# EAGLE design rs232RGBLEDController (EAGLE 8.4.0)
VERSION: 1.0a1
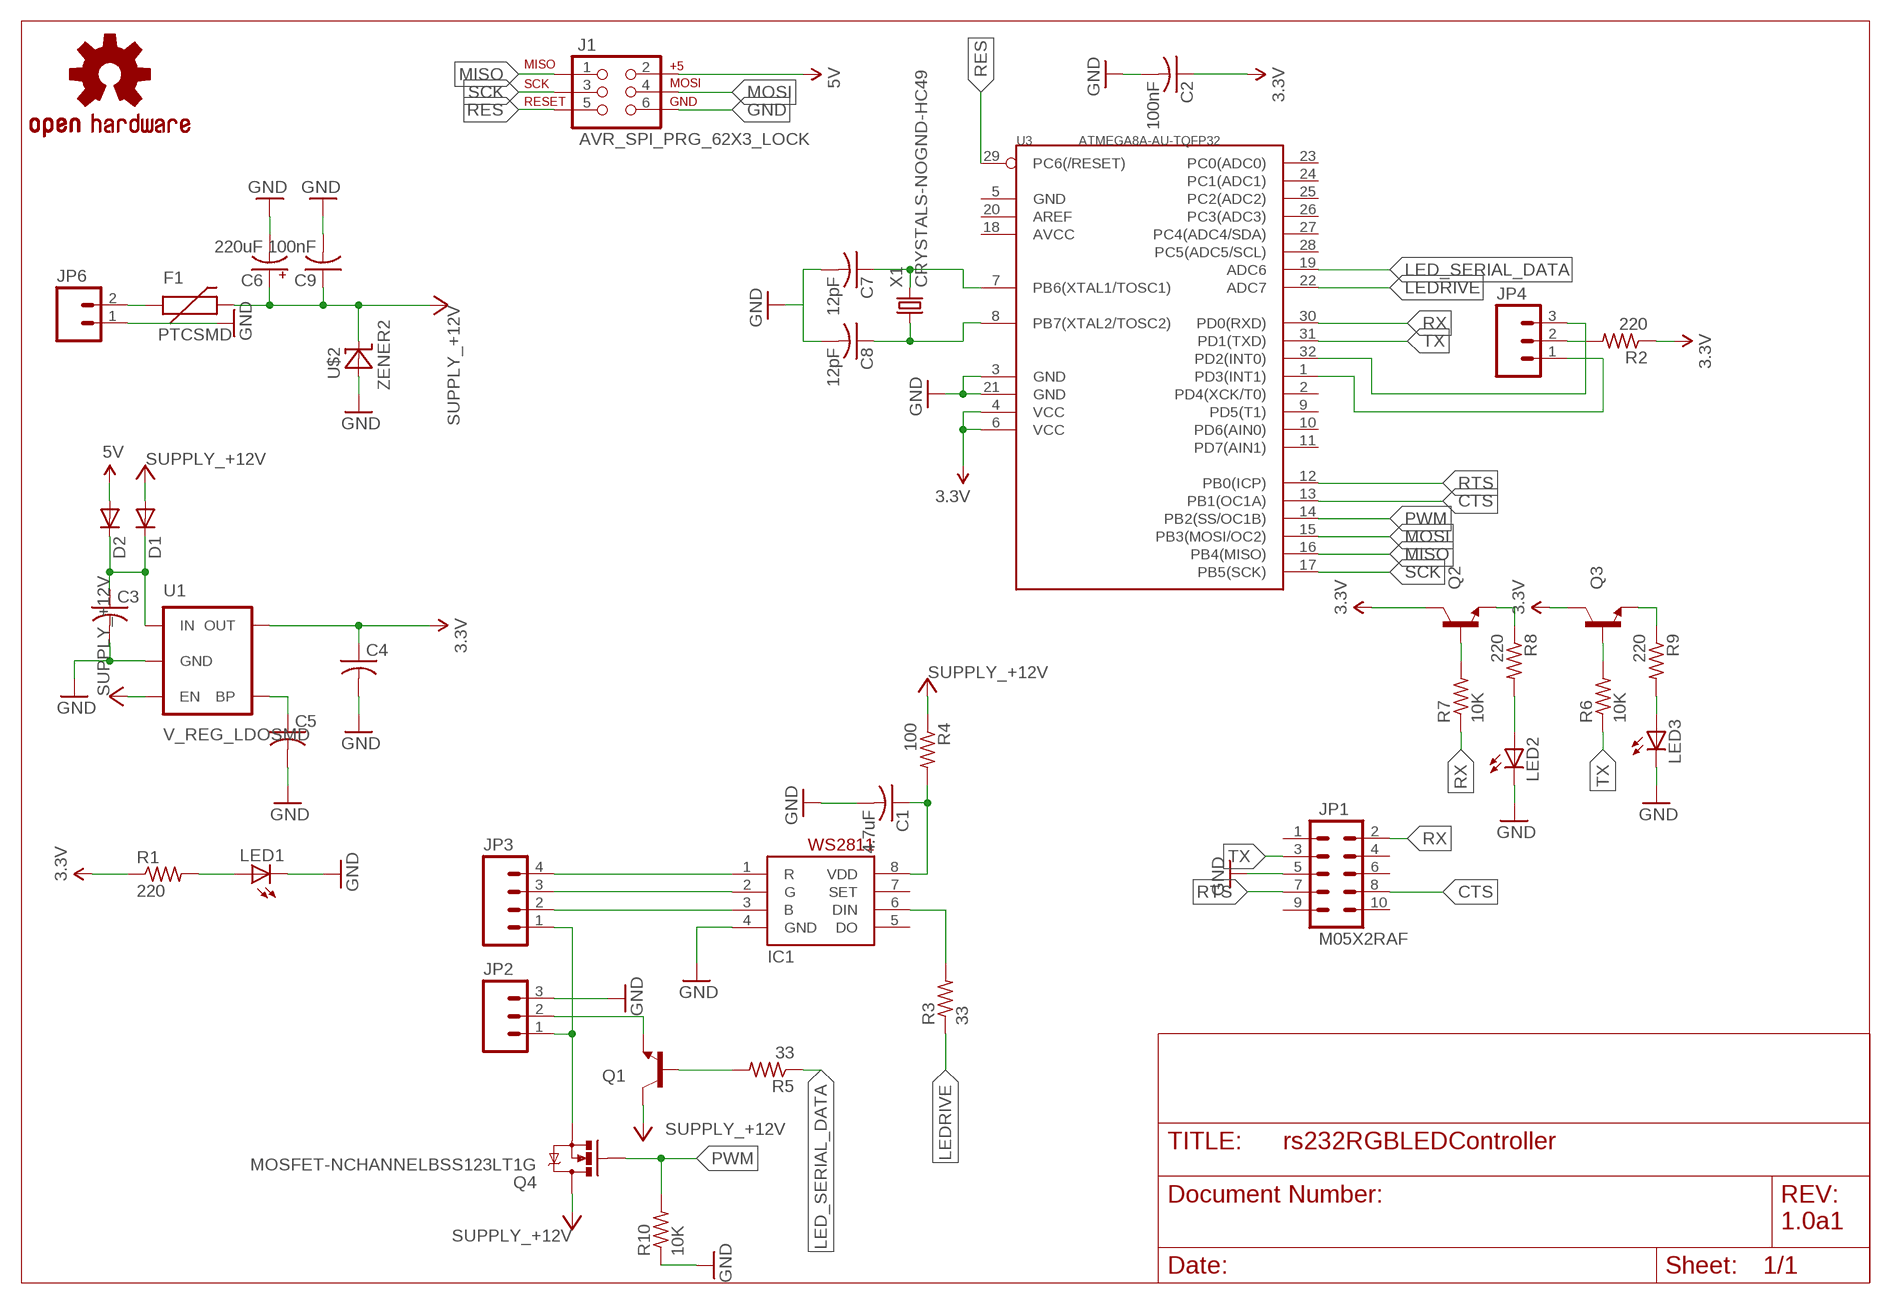
[diagram p0: schematic, sheet 1]

## Parts
C1  4.7uF  C-USC0603  [C0603]
C2  100nF  C-USC0603  [C0603]
C3  C-USC0603  [C0603]
C4  C-USC0603  [C0603]
C5  C-USC0603  [C0603]
C6  220uF  CPOL-US175TMP-0810  [175TMP-0810]
C7  12pF  C-USC0603  [C0603]
C8  12pF  C-USC0603  [C0603]
C9  100nF  C-USC0603  [C0603]
D1  DIODESOT23  [SOT23-3]
D2  DIODESOT23  [SOT23-3]
F1  PTCSMD  [PTC-1206]
IC1  WS2811-SOP8  [SO08-SKINNYPADS]
J1  AVR_SPI_PRG_62X3_LOCK  [2X3_LOCK]
JP1  M05X2RAF  [2X5-RAF]
JP2  M03PTH  [1X03]
JP3  M04PTH  [1X04]
JP4  M03PTH  [1X03]
JP6  M021X02_NO_SILK  [1X02_NO_SILK]
LED1  LED0603  [LED-0603]
LED2  LED0603  [LED-0603]
LED3  LED0603  [LED-0603]
Q1  TRANSISTOR_NPNSOT23  [SOT23]
Q2  TRANSISTOR_NPNSOT23  [SOT23]
Q3  TRANSISTOR_NPNSOT23  [SOT23]
Q4  MOSFET-NCHANNELBSS123LT1G  [SOT23-3]
R1  220  R-US_R0603  [R0603]
R2  220  R-US_R0603  [R0603]
R3  33  R-US_R0603  [R0603]
R4  100  R-US_R0603  [R0603]
R5  33  R-US_R0603  [R0603]
R6  10K  R-US_R0603  [R0603]
R7  10K  R-US_R0603  [R0603]
R8  220  R-US_R0603  [R0603]
R9  220  R-US_R0603  [R0603]
R10  10K  R-US_R0603  [R0603]
U1  V_REG_LDOSMD  [SOT23-5]
U3  ATMEGA8A-AU-TQFP32  MCU-ATMEGA8A-AU(TQFP32)  [TQFP32-0.8-7X7MM]
U$1  OSHW-LOGOS  [OSHW-LOGO-S]
U$2  ZENER2  [SOD123]
X1  CRYSTALS-NOGND-HC49  [HC49]

## Nets
3.3V: C2.1 C4.1 Q2.3(C) Q3.3(C) R1.1 R2.1 U1.5(OUT) U3.4(VCC) U3.6(VCC)
5V: D2.1(A) J1.2
+12V: C6.+ C9.1 D1.1(A) F1.2 Q1.3(C) Q4.3(D) R4.1 U1.3(EN) U$2.C ; supply symbol labelled SUPPLY_+12V
CTS: JP1.8 U3.13(PB1(OC1A))
GND: C1.2 C2.2 C3.2 C4.2 C5.2 C6.- C7.2 C8.2 C9.2 IC1.4(GND) J1.6 JP1.5 JP2.3 JP6.1 LED1.C LED2.C LED3.C R10.1 U1.2(GND) U3.3(GND) U3.21(GND) U$2.A
LED_SERIAL_DATA: R5.1 U3.19(ADC6)
LEDRIVE: R3.1 U3.22(ADC7)
MISO: J1.1 U3.16(PB4(MISO))
MOSI: J1.4 U3.15(PB3(MOSI/OC2))
N$1: Q2.1(B) R7.2
N$2: C3.1 D1.3(C) D2.3(C) U1.1(IN)
N$3: Q3.1(B) R6.2
N$4: Q2.2(E) R8.1
N$5: LED2.A R8.2
N$6: JP2.1 JP3.1 Q4.2(S)
N$7: Q3.2(E) R9.1
N$8: LED3.A R9.2
N$12: JP2.2 Q1.2(E)
N$13: LED1.A R1.2
N$14: IC1.3(B) JP3.2
N$15: C5.1 U1.4(BP)
N$16: C8.1 U3.8(PB7(XTAL2/TOSC2)) X1.1
N$17: C7.1 U3.7(PB6(XTAL1/TOSC1)) X1.2
N$18: JP4.2 R2.2
N$19: JP4.1 U3.1(PD3(INT1))
N$20: JP4.3 U3.32(PD2(INT0))
N$21: IC1.2(G) JP3.3
N$22: IC1.1(R) JP3.4
N$23: IC1.6(DIN) R3.2
N$25: C1.1 IC1.8(VDD) R4.2
N$26: Q1.1(B) R5.2
N$27: F1.1 JP6.2
PWM: Q4.1(G) R10.2 U3.14(PB2(SS/OC1B))
RES: J1.5 U3.29(PC6(/RESET))
RTS: JP1.7 U3.12(PB0(ICP))
RX: JP1.2 R7.1 U3.30(PD0(RXD))
SCK: J1.3 U3.17(PB5(SCK))
TX: JP1.3 R6.1 U3.31(PD1(TXD))
Unconnected: IC1.5(DO) IC1.7(SET) JP1.1 JP1.4 JP1.6 JP1.9 JP1.10 U3.2(PD4(XCK/T0)) U3.5(GND) U3.9(PD5(T1)) U3.10(PD6(AIN0)) U3.11(PD7(AIN1)) U3.18(AVCC) U3.20(AREF) U3.23(PC0(ADC0)) U3.24(PC1(ADC1)) U3.25(PC2(ADC2)) U3.26(PC3(ADC3)) U3.27(PC4(ADC4/SDA)) U3.28(PC5(ADC5/SCL))

## Library data of the parts
C1-C5 C7-C9 = adafruit:C-US: CAPACITOR, American symbol
C6 = adafruit:CPOL-US: POLARIZED CAPACITOR, American symbol
D1 D2 = SparkFun:DIODE: Diode These are standard reverse protection diodes and small signal diodes. SMA package can handle up to about 1A. SOD-323 can handle about 200mA. What the SOD-323 package when ordering, there are some mfgs out there that are 5-pin packages.
F1 = SparkFun:PTC: Resettable Fuse PTC Resettable Fuse. Spark Fun Electronics SKU : COM-08357
IC1 = adafruit:WS2811
J1 = SparkFun:AVR_SPI_PRG_6: AVR ISP 6 Pin This is the reduced ISP connector for AVR programming. Common on Arduino. This footprint will take up less PCB space and can be used with a 10-pin to 6-pin adapter such as SKU: BOB-08508
JP1 = SparkFun:M05X2: Header 5x2 Standard 10-pin dual row 0.1" header. Commonly used with AVR-ISP. Use with Spark Fun Electronics SKU: PRT-00778
JP2 JP4 = SparkFun:M03: Header 3 Standard 3-pin 0.1" header. Use with straight break away headers (SKU : PRT-00116), right angle break away headers (PRT-00553), swiss pins (PRT-00743), machine pins (PRT-00117), and female headers (PRT-00115). Molex polarized connector foot print use with SKU : PRT-08232 with associated crimp pins and housings.
JP3 = SparkFun:M04: Header 4 Standard 4-pin 0.1" header. Use with straight break away headers (SKU : PRT-00116), right angle break away headers (PRT-00553), swiss pins (PRT-00743), machine pins (PRT-00117), and female headers (PRT-00115). Molex polarized connector foot print use with SKU : PRT-08231 with associated crimp pins and housings. 1MM SMD Version SKU: PRT-10208
JP6 = SparkFun-Connectors:M02: Standard 2-pin 0.1" header. Use with - straight break away headers ( PRT-00116) - right angle break away headers (PRT-00553) - swiss pins (PRT-00743) - machine pins (PRT-00117) - female headers (PRT-00115) Molex polarized connector foot print use with: PRT-08233 with associated crimp pins and housings. 2.54_SCREWTERM for use with PRT-10571. 3.5mm Screw Terminal footprints for PRT-08084 5mm Screw Terminal footprints for use with PRT-08432
LED1-LED3 = SparkFun:LED: LEDs Standard schematic elements and footprints for 5mm, 3mm, 1206, and 0603 sized LEDs. 5mm - Spark Fun Electronics SKU : COM-00529 (and others)
Q1-Q3 = SparkFun:TRANSISTOR_NPN: Transistor NPN BJT configuration in SOT23 package. MMBT2222 is the common NPN we use. Double check BCE configuration again layout.
Q4 = SparkFun-DiscreteSemi:MOSFET-NCHANNEL: Common NMOSFET Parts MFG P/N Store ID Prod ID FDD8780 TRANS-09984 SI7820DN TRANS-11055 FDS6630A IC-08089 2N7002PW TRANS-11151 FQP30N06L COM-10213 TRANS-10060 BSS123LT1G TRANS-08345 BSS138 TRANS-00830 BS170 2N7000; PROD_ID: TRANS-08345
R1-R10 = adafruit:R-US_: RESISTOR, American symbol
U1 = SparkFun:V_REG_LDO: Voltage Regulator LDO Standard 150mA LDO voltage regulator in SOT-23 layout. Micrel part MIC5205. BP (by-pass) pin is used to lower output noise with 470pF cap.
U3 = Seeed-OPL-ic:MCU-ATMEGA8A-AU(TQFP32): 310010023; MPN: ATMEGA8A-AU
U$1 = SparkFun:OSHW-LOGO: Open Source Hardware Logo This logo indicates the piece of hardware it is found on incorporates a OSHW license and/or adheres to the definition of open source hardware found here: http://freedomdefined.org/OSHW
U$2 = smt_diodes:ZENER; SPICEPREFIX: B
X1 = IQD-Frequency-Products:CRYSTALS-NOGND: CRYSTALS CAN NOT GROUNDED

## Board
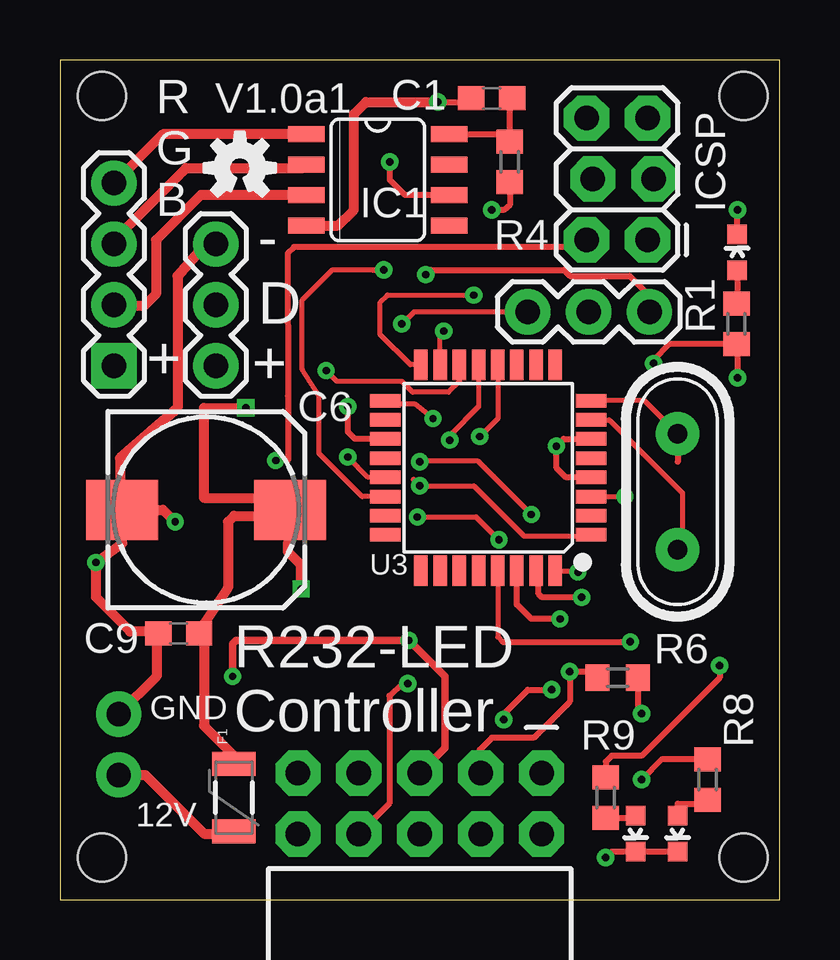
[diagram p1: board, top side]
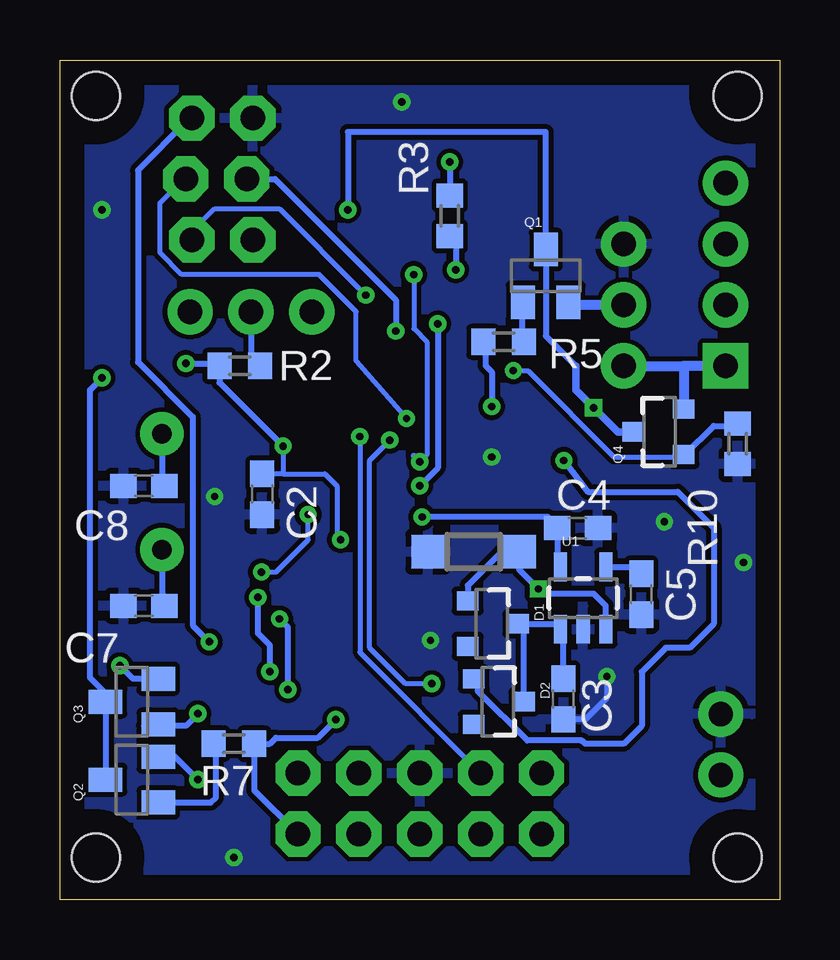
[diagram p2: board, bottom side, seen from below]

Size 30 x 35 mm. Coordinates in mm from the lower left corner, seen from the top.
Outline: 0,0 30,0 30,35 0,35 0,0
Copper layers (1*16): Top 0.035mm / dielectric 1.5mm / Bottom 0.035mm
Design rules "default *": minimum track width 10mil, minimum drill 12mil, track to track 8mil, track to pad 8mil, pad to pad 8mil, via to via 8mil, smd to smd 8mil, copper to edge 40mil, drill to drill 8mil, minimum pad ring 10mil, minimum via ring 8mil, stop-mask expansion 4mil, vias tented up to drill 13mil, thermal gap 10mil
Holes 2 mm at 28.5,1.75 1.75,1.75 1.75,33.5 28.5,33.5

### Footprints (pad centres in the part's own frame; a part is rotated, then mirrored left to right if it is on the bottom)
C0603 = smd 1.1 x 1: 1 -0.85,0; 2 0.85,0
175TMP-0810 = smd 3 x 2.5: + 3.5,0; - -3.5,0
SOT23-3 = smd 0.8 x 0.9: 1 -0.95,-1; 2 0.95,-1; 3 0,1.1
PTC-1206 = smd 1 x 1.8: 1 -1.4,0; 2 1.4,0
SO08-SKINNYPADS = smd 0.66 x 1.524: 1 -1.905,-2.973; 2 -0.635,-2.973; 3 0.635,-2.973; 4 1.905,-2.973; 5 1.905,2.973; 6 0.635,2.973; 7 -0.635,2.973; 8 -1.905,2.973
2X3_LOCK = drill 1.016 pad 1.88 octagon: 1 0,0; 2 0,2.54; 3 2.54,-0.254; 4 2.54,2.286; 5 5.08,0; 6 5.08,2.54
2X5-RAF = drill 1.016 pad 1.88 octagon: 1 -1.27,5.08; 2 1.27,5.08; 3 -1.27,2.54; 4 1.27,2.54; 5 -1.27,0; 6 1.27,0; 7 -1.27,-2.54; 8 1.27,-2.54; 9 -1.27,-5.08; 10 1.27,-5.08
1X03 = drill 1.016 pad 1.88: 1 0,0; 2 2.54,0; 3 5.08,0
1X04 = drill 1.016 pad 1.88 square: 1 0,0 | drill 1.016 pad 1.88: 2 2.54,0; 3 5.08,0; 4 7.62,0
1X02_NO_SILK = drill 1.016 pad 1.88: 1 0,0; 2 2.54,0
LED-0603 = smd 0.8 x 0.8: A 0,-0.75; C 0,0.75
SOT23 = smd 1 x 1.4: 1 -0.95,-1.1; 2 0.95,-1.1; 3 0,1.1
R0603 = smd 1 x 1.1: 1 -0.85,0; 2 0.85,0
SOT23-5 = smd 0.55 x 1.2: 1 -0.95,-1.3; 2 0,-1.3; 3 0.95,-1.3; 4 0.95,1.3; 5 -0.95,1.3
TQFP32-0.8-7X7MM = smd 1.27 x 0.559: 1 -4.293,2.8; 2 -4.293,2; 3 -4.293,1.2; 4 -4.293,0.4; 5 -4.293,-0.4; 6 -4.293,-1.2; 7 -4.293,-2; 8 -4.293,-2.8; 17 4.293,-2.8; 18 4.293,-2; 19 4.293,-1.2; 20 4.293,-0.4; 21 4.293,0.4; 22 4.293,1.2; 23 4.293,2; 24 4.293,2.8 | smd 0.559 x 1.27: 9 -2.8,-4.293; 10 -2,-4.293; 11 -1.2,-4.293; 12 -0.4,-4.293; 13 0.4,-4.293; 14 1.2,-4.293; 15 2,-4.293; 16 2.8,-4.293; 25 2.8,4.293; 26 2,4.293; 27 1.2,4.293; 28 0.4,4.293; 29 -0.4,4.293; 30 -1.2,4.293; 31 -2,4.293; 32 -2.8,4.293
SOD123 = smd 1.4 x 1.4: A 1.9,0; C -1.9,0
HC49 = drill 0.813 pad 1.8: 1 -2.413,0; 2 2.413,0

### Placement (x,y rotation side)
C1  18,33.4 180 top
C2  21.57,16.9 270 bottom
C3  9.02,8.36 270 bottom
C4  8.42,15.48 0 bottom
C5  5.77,12.73 270 bottom
C6  6.1,16.25 0 top
C7  26.5,12.25 180 bottom
C8  26.5,17.25 180 bottom
C9  4.95,11.1 180 top
D1  12,11.5 270 bottom
D2  11.75,8.25 270 bottom
F1  7.25,4.25 90 top
IC1  13.25,30 270 top
J1  24.5,27.5 90 top
JP1  15,4 270 top
JP2  6.5,22.25 90 top
JP3  2.25,22.25 90 top
JP4  19.5,24.5 0 top
JP6  2.45,7.73 270 top
LED1  28.23,26.98 0 top
LED2  25.75,2.75 180 top
LED3  24,2.75 180 top
Q1  9.75,26 0 bottom
Q2  27,5 90 bottom
Q3  27,8.25 90 bottom
Q4  5,19.5 90 bottom
R1  28.2,24 90 top
R2  22.5,22.25 0 bottom
R3  13.75,28.5 90 bottom
R4  18.75,30.75 90 top
R5  11.5,23.25 0 bottom
R6  23.25,9.25 0 top
R7  22.75,6.5 180 bottom
R8  27,5 270 top
R9  22.75,4.25 270 top
R10  1.75,19 90 bottom
U1  8.19,12.57 0 bottom
U3  17.85,18 180 top
U$1  7.5,30.5 0 top
U$2  12.75,14.5 180 bottom
X1  25.75,17 270 top

### Tracks (layer width: path | path; a pad name or v marks a point on that pad's centre or on a via)
3.3V  (via drill 0.3)
  Top 0.203: v18.3,15 17.35,15.95 v14.9,15.95
  Top 0.254: v28.25,21.75 28.25,23.1 R1.1 25.4,23.15 24.75,22.5 v24.75,22.35 | U3.4 21.3,17.6 21.1,17.6 20.7,18 v20.7,18.9 21,19.2 U3.6
  Bottom 0.203: 20.7,17.75 C2.1 | 20.7,17.75 18.95,17.75 18.45,17.25 18.45,15.15 v18.3,15 | v20.7,18.9 20.7,17.75
  Bottom 0.254: 9.27,15.3 C4.1 | 9.27,15.3 9.27,14 U1.5 | Q2.3 Q3.3 28.1,8.6 28.75,9.25 28.75,21.25 v28.25,21.75 | v14.9,15.95 9.67,15.95 9.49,15.77 9.49,15.52 9.27,15.3 | v24.75,22.35 23.45,22.35 R2.1 23.35,21.55 v20.7,18.9
5V  (via drill 0.3)
  Top 0.254: v8.99,18.3 9.5,18.3 9.5,21 9.49,26.94 9.76,27.2 21.72,27.2 21.95,27.43 J1.2
  Bottom 0.254: 8.23,6.63 10.52,6.63 12.57,8.69 12.57,9.14 D2.1 | v8.99,18.3 8,17 4.25,17 2.75,15.5 2.75,11.5 3.75,10.5 4.75,10.5 5.75,9.5 5.75,7.25 6.5,6.5 8.1,6.5 8.23,6.63 | 8.25,6.61 8.23,6.63
+12V  (via drill 0.3, 0.3 pad 0.3)
  Top 0.254: R4.1 18.75,28.95 18.5,28.75 v18,28.75 | C9.1 5.85,11.1 6,10.95 | 9.5,16.15 C6.+ 9.5,16.15 | 9.5,14.85 9.5,16.15
  Top 0.406: F1.2 7.25,6 6,7.25 6,10.95 6,11.5 7,13 7,15.75 7.25,16 9.35,16 9.5,16.15 9.5,14.85 9.5,14.5 10.05,13.95 v10.05,12.95 | v7.75,20.5 6,20.5 6,16.75 9.1,16.75 C6.+
  Bottom 0.254: v18,28.75 18,32 9.75,32 Q1.3 9.75,23.5 8.5,22.25 | U1.3 7.24,12.24 7.75,12.75 9.66,12.75 10.1,12.89 10.1,12.9 10.05,12.9 v10.05,12.95 10.85,13.75 U$2.C | U$2.C 11.5,14.4 10.9,14.4 | D1.1 13,13.1 11.6,14.5 U$2.C
  Bottom 0.305: Q4.3 6.75,19.5 v7.75,20.5 8.5,21.25 8.5,22.25
CTS  (via drill 0.3)
  Top 0.203: U3.13 17.45,20.55 16.25,19.35 v16.25,19.15
  Top 0.254: v14.5,9 14.25,9 13.73,8.5 13.73,4.02 JP1.8
  Bottom 0.203: v14.5,9 15.59,9 17.09,10.5 17.09,18.31 v16.25,19.15
GND  (via drill 0.3)
  Top 0.203: U3.3 v23.55,16.8 | U3.21 12.85,17.6 v12,18.45
  Top 0.254: LED1.C 28.23,28.73 v28.25,28.75 | LED2.C LED3.C 23,2 v22.75,1.75 | v15.75,33.25 17,33.25 C1.2
  Top 0.305: v7.2,9.3 7.2,10.65 7.35,10.8 v14.55,10.8 16.05,9.3 16.05,6.32 JP1.5
  Top 0.406: IC1.4 11.6,28.09 12.25,28.75 12.25,32.75 12.75,33.25 v15.75,33.25 | JP2.3 6.08,27.33 4.9,26 4.9,20.5 2.5,18.4 2.5,16.35 C6.- | C6.- 4.3,16.25 v4.8,15.75 | JP6.1 4.05,9.33 4.05,11.05 C9.2 4.03,11.18 2.92,11.18 1.5,12.6 v1.5,14.05 2.6,14.85 C6.-
  Bottom 0.254: C3.2 8.1,7.51 7.2,8.41 v7.2,9.3
  pour Bottom: -1,42.5 36.75,42.5 36.75,-4 -1,-4
LED_SERIAL_DATA  (via drill 0.3)
  Top 0.254: U3.19 12.3,19.2 12,19.5 v12,20.55
  Bottom 0.254: R5.1 12.25,23.15 12.25,22.25 12.03,22.02 12,22 v12,20.55
LEDRIVE  (via drill 0.3)
  Top 0.203: U3.22 12.6,16.8 10.8,18.6 10.8,21 10.1,22.1 10.1,25 11.35,26.25 v13.5,26.25 13,26.25
  Bottom 0.254: v13.5,26.25 13.5,27.4 R3.1
MISO  (via drill 0.3)
  Top 0.203: U3.16 14.61,22.29 13.35,23.55 13.35,24.9 13.65,25.2 v17.25,25.2
  Bottom 0.203: J1.1 24.5,27.85 23.55,28.8 22.73,28.8 20.84,28.8 17.4,25.35 v17.25,25.2
MOSI  (via drill 0.3)
  Top 0.203: U3.15 15.85,23.55 v16,23.7
  Bottom 0.254: J1.4 21.04,30.04 16,25 v16,23.7
N$1
  Bottom 0.254: 23.75,6.35 R7.2 23.5,6.4 23.5,4.25 23.7,4.05 Q2.1
N$2
  Bottom 0.254: D2.3 10.65,11.25 D1.3 9.37,11.5 U1.1 9.02,11.15 C3.1
N$3  (via drill 0.3)
  Top 0.254: R6.2 24.1,7.9 v24.25,7.75
  Bottom 0.254: v24.25,7.75 24.75,7.25 25.95,7.25 | 26.5,7.25 25.95,7.25 | 25.95,7.25 Q3.1
N$4  (via drill 0.3)
  Top 0.254: R8.1 25.1,5.85 v24.25,5
  Bottom 0.254: v24.25,5 25.25,6 25.85,6 Q2.2
N$5
  Top 0.254: LED2.A 25.75,4 26.85,4 R8.2
N$6
  Bottom 0.406: JP3.1 4,22.25 | 4,22.25 Q4.2 | JP2.1 4,22.25
N$7  (via drill 0.3)
  Top 0.254: v27.5,9.75 27.5,9.25 24.25,6 23,6 22.75,5.75 R9.1
  Bottom 0.254: Q3.2 26.95,9.2 v27.5,9.75
N$8
  Top 0.254: R9.2 23.9,3.4 LED3.A
N$12
  Bottom 0.406: JP2.2 8.69,24.79 Q1.2
N$13
  Top 0.254: LED1.A 28.23,24.88 R1.2
N$14
  Top 0.406: IC1.3 5.87,29.36 4,27.5 4,25.25 3.5,24.75 2.29,24.75 JP3.2
N$15
  Bottom 0.254: U1.4 6.06,13.87 C5.1
N$16
  Top 0.203: U3.8 24.36,20.8 X1.1
  Top 0.254: X1.1 25.75,18.25
  Bottom 0.254: X1.1 25.75,17.35 C8.1
N$17
  Top 0.203: U3.7 22.9,20 25.95,16.95 25.95,14.79 X1.2
  Top 0.254: X1.2 25.26,15.08
  Bottom 0.254: X1.2 25.75,12.35 C7.1
N$18
  Bottom 0.254: JP4.2 22.04,22.64 R2.2
N$19  (via drill 0.3)
  Top 0.203: JP4.1 14.75,24.5 v14.25,24 | U3.1 22.09,15.15 19.35,15.15 17.25,17.25 v15,17.25
  Top 0.254: 14.75,17.5 v15,17.25
  Bottom 0.254: v14.25,24 14.25,18 v15,17.25
N$20  (via drill 0.3)
  Top 0.203: v15,18.25 15.05,18.3 17.4,18.3 v19.65,16.05 | 20.55,13.81 U3.32 21.54,13.71 v21.6,13.65
  Top 0.254: v15.25,26.05 15.45,26.25 21,26.25 21.25,26 23.75,26 24.5,25.25 24.5,24.58 JP4.3
  Bottom 0.203: v21.6,13.65 21,13.65 19.65,15 v19.65,16.05 | v15.25,26.05 15.25,23.8 14.7,23.25 14.7,18.55 v15,18.25
  Bottom 0.254: v15,18.25 15.25,18.5
N$21
  Top 0.406: JP3.3 2.25,27.5 5.25,30.5 10.14,30.5 IC1.2
N$22
  Top 0.406: IC1.1 4.29,31.91 JP3.4
N$23  (via drill 0.3)
  Top 0.254: IC1.6 14.38,29.36 13.75,30 v13.75,30.75
  Bottom 0.254: v13.75,30.75 R3.2
N$25
  Top 0.254: IC1.8 18.7,31.91 R4.2 18.75,33.15 C1.1
N$26
  Bottom 0.254: Q1.1 10.75,24.85 10.75,23.35 R5.2
N$27
  Top 0.406: F1.1 7.15,2.75 6,2.75 3.56,5.19 JP6.2
PWM  (via drill 0.3)
  Top 0.203: 16.65,22.65 U3.14 | U3.14 16.65,21.6 | 16.65,21.6 16.2,21.15 | U3.14 16.65,21.6 | 16.65,21.6 16.2,21.15 | 16.2,21.15 14.7,21.15 14.25,21.6 11.55,21.6 v11.1,22.05
  Bottom 0.203: v11.1,22.05 10.5,22.05 6.9,18.45 4.1,18.45 Q4.1
  Bottom 0.254: Q4.1 3.95,18.55 2.75,19.75 1.85,19.75 R10.2
RES  (via drill 0.3)
  Top 0.203: U3.29 18.25,10.94 18.45,10.74
  Top 0.254: 18.45,10.74 v23.77,10.74
  Bottom 0.254: v23.77,10.74 24.46,11.43 24.46,20.12 26.75,22.4 26.75,30.4 24.69,32.46 J1.5
RTS  (via drill 0.3)
  Top 0.203: U3.12 18.25,20.05 v17.5,19.3
  Bottom 0.203: v17.5,19.3 17.5,10.31 JP1.7
RX  (via drill 0.3)
  Top 0.254: v18.5,7.5 18.5,7.75 19.5,8.75 v20.5,8.75 | v20.85,11.7 19.65,11.7 19.05,12.3 U3.30
  Bottom 0.254: JP1.2 21.9,4.55 R7.1 21.25,6.5 21,6.75 19.25,6.75 v18.5,7.5 | v20.5,8.75 20.5,11.35 v20.85,11.7
SCK  (via drill 0.3)
  Top 0.203: v15.55,20.05 14.8,20.65 13.71,20.65 U3.17
  Bottom 0.203: v15.55,20.05 17.65,22.45 17.65,24.5 19.2,26.06 24.92,26.06 25.83,26.98 25.83,29.03 24.92,29.95
  Bottom 0.254: 24.54,30.04 J1.3 24.92,29.95
TX  (via drill 0.3)
  Top 0.254: R6.1 22.25,9.25 22,9.5 v21.25,9.5 21.25,8.25 19.75,6.75 18,6.75 17.5,6.25 17.5,5.31 JP1.3 | v21.75,12.6 20.1,12.6 19.95,12.75 19.95,13.61 U3.31
  Bottom 0.254: v21.25,9.5 21.25,10.6 21.75,11.1 v21.75,12.6

### Text on the board
tPlace: ICSP | R / G / B | - | D | + | + | GND | R232-LED / Controller | 12V